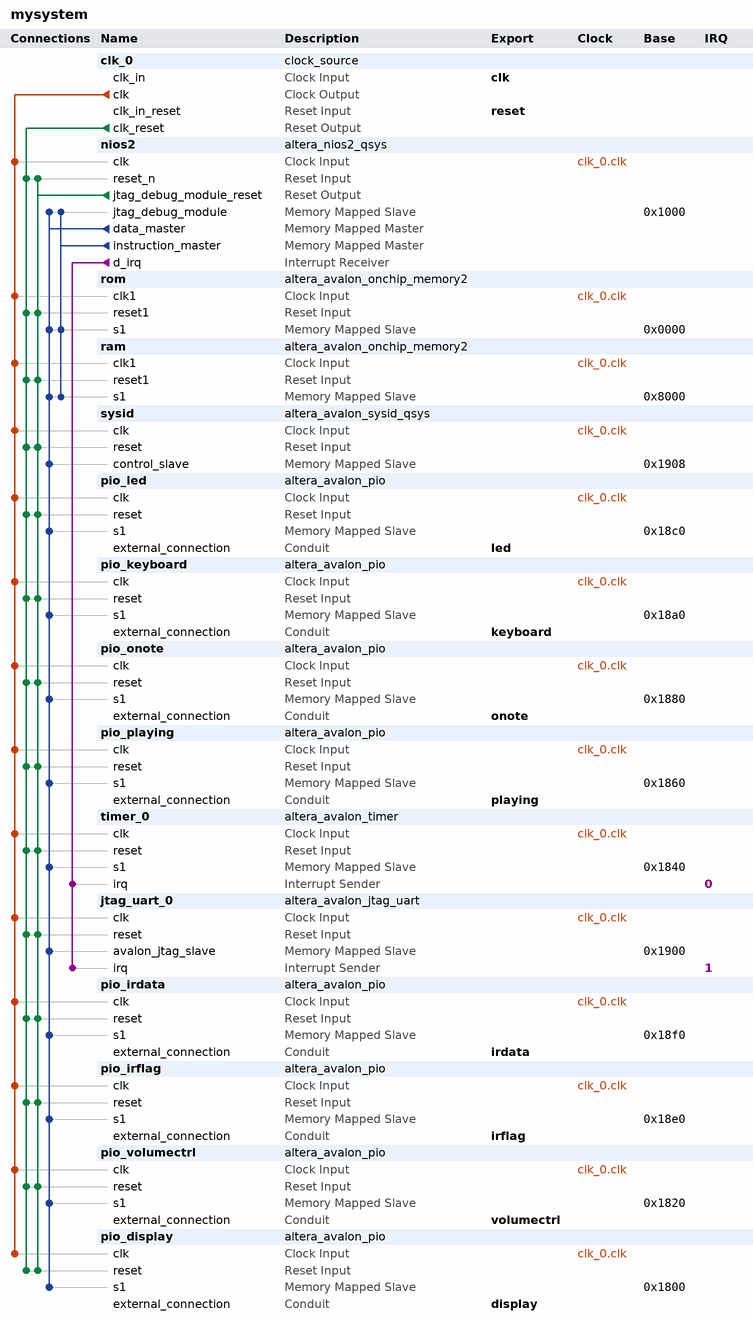
[diagram p0: system contents]
# Platform Designer (Qsys) system mysystem, Cyclone IV E EP4CE6F17C8
# Parameters at their usual value, and those the tool derives, are not listed.
package require -exact qsys 13.1
create_system mysystem
set_project_property DEVICE_FAMILY {Cyclone IV E}
set_project_property DEVICE EP4CE6F17C8

add_instance clk_0 clock_source 13.1
set_instance_parameter_value clk_0 clockFrequency 50000000

add_instance nios2 altera_nios2_qsys 13.1
set_instance_parameter_value nios2 resetSlave rom.s1
set_instance_parameter_value nios2 mmu_TLBMissExcSlave None
set_instance_parameter_value nios2 exceptionSlave ram.s1
set_instance_parameter_value nios2 breakSlave nios2.jtag_debug_module
set_instance_parameter_value nios2 impl Fast
set_instance_parameter_value nios2 icache_size 4096

add_instance rom altera_avalon_onchip_memory2 13.1
set_instance_parameter_value rom dataWidth 32
set_instance_parameter_value rom dualPort false
set_instance_parameter_value rom initMemContent true
set_instance_parameter_value rom initializationFileName onchip_mem.hex
set_instance_parameter_value rom memorySize 2048
set_instance_parameter_value rom writable false

add_instance ram altera_avalon_onchip_memory2 13.1
set_instance_parameter_value ram dataWidth 32
set_instance_parameter_value ram dualPort false
set_instance_parameter_value ram initMemContent true
set_instance_parameter_value ram initializationFileName onchip_mem.hex
set_instance_parameter_value ram memorySize 13000

add_instance sysid altera_avalon_sysid_qsys 13.1
set_instance_parameter_value sysid id -2023406815

add_instance pio_led altera_avalon_pio 13.1
set_instance_parameter_value pio_led bitModifyingOutReg true
set_instance_parameter_value pio_led direction Output
set_instance_parameter_value pio_led resetValue 15
set_instance_parameter_value pio_led width 8

add_instance pio_keyboard altera_avalon_pio 13.1
set_instance_parameter_value pio_keyboard bitModifyingOutReg true
set_instance_parameter_value pio_keyboard direction Input
set_instance_parameter_value pio_keyboard width 8

add_instance pio_onote altera_avalon_pio 13.1
set_instance_parameter_value pio_onote bitModifyingOutReg true
set_instance_parameter_value pio_onote direction Output
set_instance_parameter_value pio_onote width 8

add_instance pio_playing altera_avalon_pio 13.1
set_instance_parameter_value pio_playing bitModifyingOutReg true
set_instance_parameter_value pio_playing direction Output
set_instance_parameter_value pio_playing width 8

add_instance timer_0 altera_avalon_timer 13.1
set_instance_parameter_value timer_0 period 1
set_instance_parameter_value timer_0 periodUnits MSEC

add_instance jtag_uart_0 altera_avalon_jtag_uart 13.1
set_instance_parameter_value jtag_uart_0 simInteractiveOptions NO_INTERACTIVE_WINDOWS

add_instance pio_irdata altera_avalon_pio 13.1
set_instance_parameter_value pio_irdata direction Input
set_instance_parameter_value pio_irdata width 16

add_instance pio_irflag altera_avalon_pio 13.1
set_instance_parameter_value pio_irflag direction Input
set_instance_parameter_value pio_irflag width 8

add_instance pio_volumectrl altera_avalon_pio 13.1
set_instance_parameter_value pio_volumectrl bitModifyingOutReg true
set_instance_parameter_value pio_volumectrl direction Output
set_instance_parameter_value pio_volumectrl width 8

add_instance pio_display altera_avalon_pio 13.1
set_instance_parameter_value pio_display bitModifyingOutReg true
set_instance_parameter_value pio_display direction Output
set_instance_parameter_value pio_display width 32

# connections
add_connection clk_0.clk jtag_uart_0.clk clock
add_connection clk_0.clk nios2.clk clock
add_connection clk_0.clk pio_display.clk clock
add_connection clk_0.clk pio_irdata.clk clock
add_connection clk_0.clk pio_irflag.clk clock
add_connection clk_0.clk pio_keyboard.clk clock
add_connection clk_0.clk pio_led.clk clock
add_connection clk_0.clk pio_onote.clk clock
add_connection clk_0.clk pio_playing.clk clock
add_connection clk_0.clk pio_volumectrl.clk clock
add_connection clk_0.clk ram.clk1 clock
add_connection clk_0.clk rom.clk1 clock
add_connection clk_0.clk sysid.clk clock
add_connection clk_0.clk timer_0.clk clock
add_connection clk_0.clk_reset jtag_uart_0.reset reset
add_connection clk_0.clk_reset nios2.reset_n reset
add_connection clk_0.clk_reset pio_display.reset reset
add_connection clk_0.clk_reset pio_irdata.reset reset
add_connection clk_0.clk_reset pio_irflag.reset reset
add_connection clk_0.clk_reset pio_keyboard.reset reset
add_connection clk_0.clk_reset pio_led.reset reset
add_connection clk_0.clk_reset pio_onote.reset reset
add_connection clk_0.clk_reset pio_playing.reset reset
add_connection clk_0.clk_reset pio_volumectrl.reset reset
add_connection clk_0.clk_reset ram.reset1 reset
add_connection clk_0.clk_reset rom.reset1 reset
add_connection clk_0.clk_reset sysid.reset reset
add_connection clk_0.clk_reset timer_0.reset reset
add_connection nios2.jtag_debug_module_reset jtag_uart_0.reset reset
add_connection nios2.jtag_debug_module_reset nios2.reset_n reset
add_connection nios2.jtag_debug_module_reset pio_display.reset reset
add_connection nios2.jtag_debug_module_reset pio_irdata.reset reset
add_connection nios2.jtag_debug_module_reset pio_irflag.reset reset
add_connection nios2.jtag_debug_module_reset pio_keyboard.reset reset
add_connection nios2.jtag_debug_module_reset pio_led.reset reset
add_connection nios2.jtag_debug_module_reset pio_onote.reset reset
add_connection nios2.jtag_debug_module_reset pio_playing.reset reset
add_connection nios2.jtag_debug_module_reset pio_volumectrl.reset reset
add_connection nios2.jtag_debug_module_reset ram.reset1 reset
add_connection nios2.jtag_debug_module_reset rom.reset1 reset
add_connection nios2.jtag_debug_module_reset sysid.reset reset
add_connection nios2.jtag_debug_module_reset timer_0.reset reset
add_connection nios2.data_master jtag_uart_0.avalon_jtag_slave avalon
set_connection_parameter_value nios2.data_master/jtag_uart_0.avalon_jtag_slave baseAddress 0x1900
add_connection nios2.data_master nios2.jtag_debug_module avalon
set_connection_parameter_value nios2.data_master/nios2.jtag_debug_module baseAddress 0x1000
add_connection nios2.data_master pio_display.s1 avalon
set_connection_parameter_value nios2.data_master/pio_display.s1 baseAddress 0x1800
add_connection nios2.data_master pio_irdata.s1 avalon
set_connection_parameter_value nios2.data_master/pio_irdata.s1 baseAddress 0x18f0
add_connection nios2.data_master pio_irflag.s1 avalon
set_connection_parameter_value nios2.data_master/pio_irflag.s1 baseAddress 0x18e0
add_connection nios2.data_master pio_keyboard.s1 avalon
set_connection_parameter_value nios2.data_master/pio_keyboard.s1 baseAddress 0x18a0
add_connection nios2.data_master pio_led.s1 avalon
set_connection_parameter_value nios2.data_master/pio_led.s1 baseAddress 0x18c0
add_connection nios2.data_master pio_onote.s1 avalon
set_connection_parameter_value nios2.data_master/pio_onote.s1 baseAddress 0x1880
add_connection nios2.data_master pio_playing.s1 avalon
set_connection_parameter_value nios2.data_master/pio_playing.s1 baseAddress 0x1860
add_connection nios2.data_master pio_volumectrl.s1 avalon
set_connection_parameter_value nios2.data_master/pio_volumectrl.s1 baseAddress 0x1820
add_connection nios2.data_master ram.s1 avalon
set_connection_parameter_value nios2.data_master/ram.s1 baseAddress 0x8000
add_connection nios2.data_master rom.s1 avalon
set_connection_parameter_value nios2.data_master/rom.s1 baseAddress 0x0000
add_connection nios2.data_master sysid.control_slave avalon
set_connection_parameter_value nios2.data_master/sysid.control_slave baseAddress 0x1908
add_connection nios2.data_master timer_0.s1 avalon
set_connection_parameter_value nios2.data_master/timer_0.s1 baseAddress 0x1840
add_connection nios2.instruction_master nios2.jtag_debug_module avalon
set_connection_parameter_value nios2.instruction_master/nios2.jtag_debug_module baseAddress 0x1000
add_connection nios2.instruction_master ram.s1 avalon
set_connection_parameter_value nios2.instruction_master/ram.s1 baseAddress 0x8000
add_connection nios2.instruction_master rom.s1 avalon
set_connection_parameter_value nios2.instruction_master/rom.s1 baseAddress 0x0000
add_connection nios2.d_irq jtag_uart_0.irq interrupt
set_connection_parameter_value nios2.d_irq/jtag_uart_0.irq irqNumber 1
add_connection nios2.d_irq timer_0.irq interrupt
set_connection_parameter_value nios2.d_irq/timer_0.irq irqNumber 0

# exported interfaces
add_interface clk clock sink
set_interface_property clk EXPORT_OF clk_0.clk_in
add_interface reset reset sink
set_interface_property reset EXPORT_OF clk_0.clk_in_reset
add_interface led conduit end
set_interface_property led EXPORT_OF pio_led.external_connection
add_interface keyboard conduit end
set_interface_property keyboard EXPORT_OF pio_keyboard.external_connection
add_interface onote conduit end
set_interface_property onote EXPORT_OF pio_onote.external_connection
add_interface playing conduit end
set_interface_property playing EXPORT_OF pio_playing.external_connection
add_interface irdata conduit end
set_interface_property irdata EXPORT_OF pio_irdata.external_connection
add_interface irflag conduit end
set_interface_property irflag EXPORT_OF pio_irflag.external_connection
add_interface volumectrl conduit end
set_interface_property volumectrl EXPORT_OF pio_volumectrl.external_connection
add_interface display conduit end
set_interface_property display EXPORT_OF pio_display.external_connection

set_interconnect_requirement {$system} qsys_mm.clockCrossingAdapter HANDSHAKE
set_interconnect_requirement {$system} qsys_mm.maxAdditionalLatency 1
set_interconnect_requirement {$system} qsys_mm.insertDefaultSlave false

save_system mysystem.qsys
